# Altium schematic sheet Car_Circuitry.SchDoc
size A3; SheetNumber: 1; SheetTotal: 1
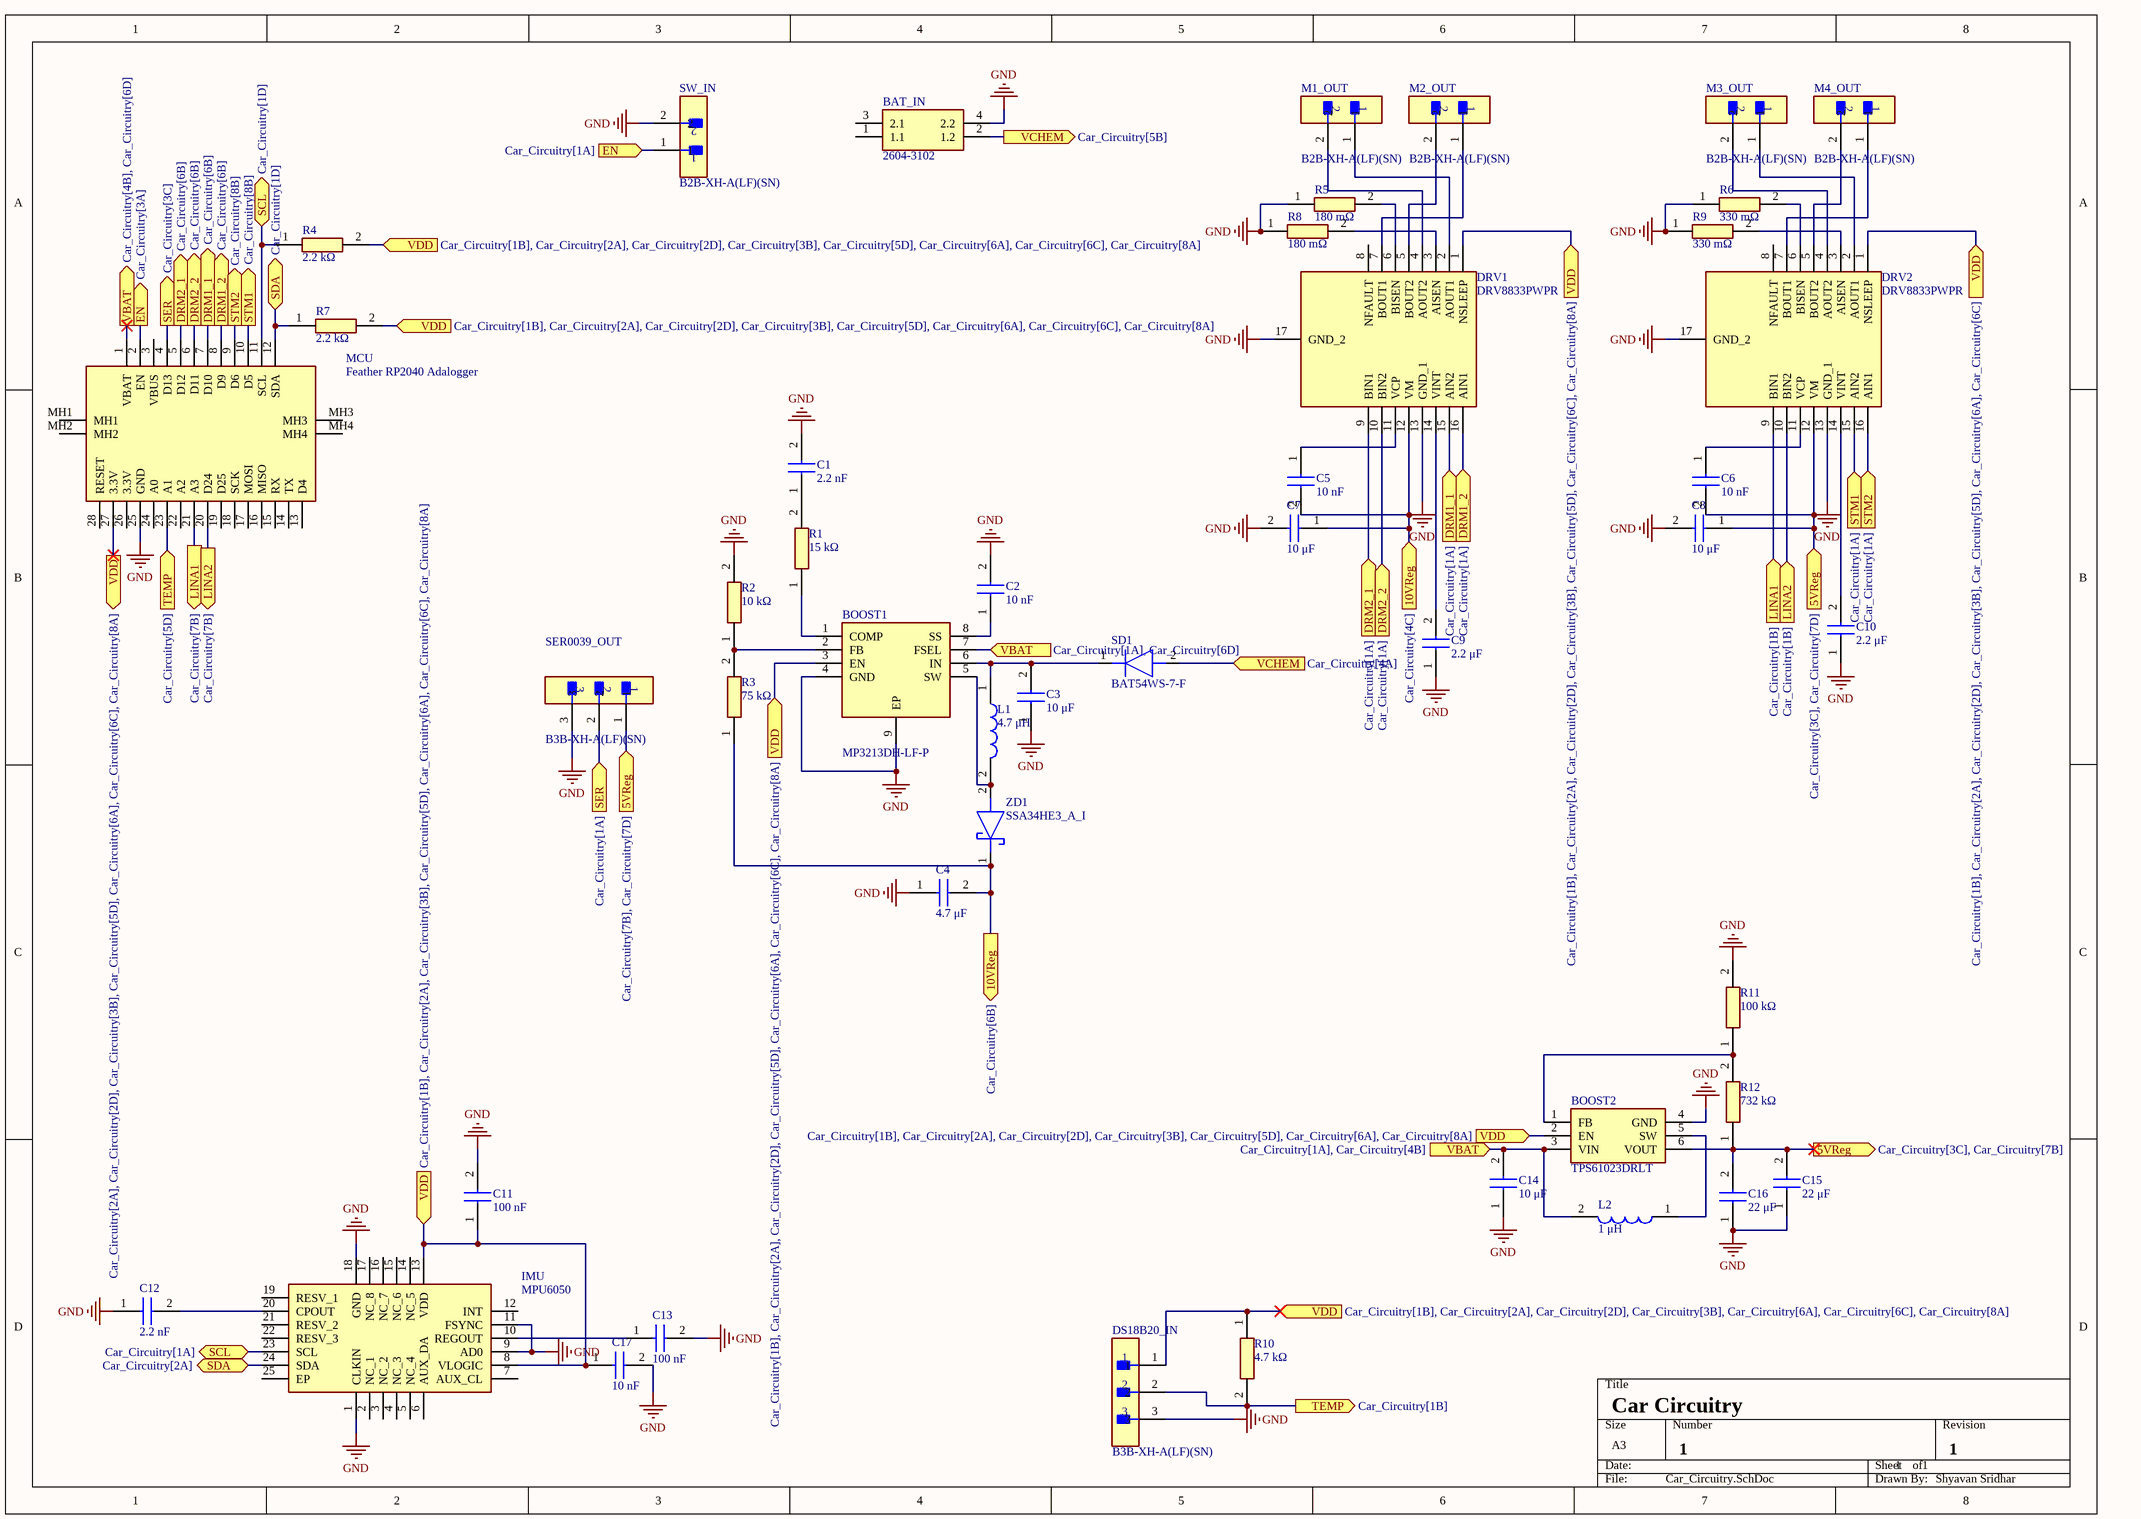
[diagram p0: Car_Circuitry.SchDoc]

## Parts
BAT_IN  2604-3102  [26043102]
BOOST1  MP3213DH-LF-P  [SOP65P490X110-9N]
BOOST2  TPS61023DRLT  [SOTFL50P160X60-6N]
C1  2.2 nF  [CAPC2012X75N]
C2  10 nF  [CAPC2012X75N]
C3  10 μF  [CAPC2012X140N]
C4  4.7 μF  [CAPC2012X135N]
C5  10 nF  [CAPC2012X75N]
C6  10 nF  [CAPC2012X75N]
C7  10 μF  [CAPC2012X140N]
C8  10 μF  [CAPC2012X140N]
C9  2.2 μF  [CAPC2012X135N]
C10  2.2 μF  [CAPC2012X135N]
C11  100 nF  [CAPC2012X95N]
C12  2.2 nF  [CAPC2012X75N]
C13  100 nF  [CAPC2012X95N]
C14  10 μF  [CAPC2012X140N]
C15  22 μF  [CAPC3216X180N]
C16  22 μF  [CAPC3216X180N]
C17  10 nF  [CAPC2012X75N]
DRV1  DRV8833PWPR  [SOP65P640X120-17N]
DRV2  DRV8833PWPR  [SOP65P640X120-17N]
DS18B20_IN  B3B-XH-A(LF)(SN)  [FP-B3B-XH-A_LF_SN-MFG]
IMU  MPU6050  [MPU6050]
L1  4.7 μH  [CDRH8D43NP4R7NC]
L2  1 μH  [74438357010]
M1_OUT  B2B-XH-A(LF)(SN)  [FP-B2B-XH-A_LF_SN-MFG]
M2_OUT  B2B-XH-A(LF)(SN)  [FP-B2B-XH-A_LF_SN-MFG]
M3_OUT  B2B-XH-A(LF)(SN)  [FP-B2B-XH-A_LF_SN-MFG]
M4_OUT  B2B-XH-A(LF)(SN)  [FP-B2B-XH-A_LF_SN-MFG]
MCU  Feather RP2040 Adalogger  [2796]
R1  15 kΩ  [RESC3216X70N]
R2  10 kΩ  [RESC3216X70N]
R3  75 kΩ  [RESC3116X65N]
R4  2.2 kΩ  [RESAD1042W49L330D178]
R5  180 mΩ  [ERJ6_B_BW_R_LW_CW_D]
R6  330 mΩ  [ERJ6_B_BW_R_LW_CW_D]
R7  2.2 kΩ  [RESAD1042W49L330D178]
R8  180 mΩ  [ERJ6_B_BW_R_LW_CW_D]
R9  330 mΩ  [ERJ6_B_BW_R_LW_CW_D]
R10  4.7 kΩ  [RESAD1530W60L610D230]
R11  100 kΩ  [ERJ8ENF1000V]
R12  732 kΩ  [ERJ8ENF1000V]
SD1  BAT54WS-7-F  [SOD2513X120N]
SER0039_OUT  B3B-XH-A(LF)(SN)  [FP-B3B-XH-A_LF_SN-MFG]
SW_IN  B2B-XH-A(LF)(SN)  [FP-B2B-XH-A_LF_SN-MFG]
ZD1  SSA34HE3_A_I  [DIONM5127X229N]

## Ports
5VReg (in, see Car_Circuitry[3C], Car_Circuitry[7D]), 5VReg (in, see Car_Circuitry[7B], Car_Circuitry[7D]), 5VReg (out, see Car_Circuitry[3C], Car_Circuitry[7B]), 10VReg (in, see Car_Circuitry[4C]), 10VReg (out, see Car_Circuitry[6B]), DRM1_1 (in, see Car_Circuitry[1A]), DRM1_1 (out, see Car_Circuitry[6B]), DRM1_2 (in, see Car_Circuitry[1A]), DRM1_2 (out, see Car_Circuitry[6B]), DRM2_1 (in, see Car_Circuitry[1A]), DRM2_1 (out, see Car_Circuitry[6B]), DRM2_2 (in, see Car_Circuitry[1A]), DRM2_2 (out, see Car_Circuitry[6B]), EN (in, see Car_Circuitry[1A]), EN (out, see Car_Circuitry[3A]), LINA1 (in, see Car_Circuitry[1B]), LINA1 (out, see Car_Circuitry[7B]), LINA2 (in, see Car_Circuitry[1B]), LINA2 (out, see Car_Circuitry[7B]), SCL (bidir, see Car_Circuitry[1A]), SCL (bidir, see Car_Circuitry[1D]), SDA (bidir, see Car_Circuitry[1D]), SDA (bidir, see Car_Circuitry[2A]), SER (in, see Car_Circuitry[1A]), SER (out, see Car_Circuitry[3C]), STM1 (in, see Car_Circuitry[1A]), STM1 (out, see Car_Circuitry[8B]), STM2 (in, see Car_Circuitry[1A]), STM2 (out, see Car_Circuitry[8B]), TEMP (in, see Car_Circuitry[5D]), TEMP (out, see Car_Circuitry[1B]), VBAT (in, see Car_Circuitry[1A], Car_Circuitry[4B]), VBAT (in, see Car_Circuitry[1A], Car_Circuitry[6D]), VBAT (out, see Car_Circuitry[4B], Car_Circuitry[6D]), VCHEM (in, see Car_Circuitry[4A]), VCHEM (out, see Car_Circuitry[5B]), VDD (in, see Car_Circuitry[1B], Car_Circuitry[2A], Car_Circuitry[2D], Car_Circuitry[3B], Car_Circuitry[5D], Car_Circuitry[6A], Car_Circuitry[6C]), VDD (in, see Car_Circuitry[1B], Car_Circuitry[2A], Car_Circuitry[2D], Car_Circuitry[3B], Car_Circuitry[5D], Car_Circuitry[6A], Car_Circuitry[6C], Car_Circuitry[8A]), VDD (in, see Car_Circuitry[1B], Car_Circuitry[2A], Car_Circuitry[2D], Car_Circuitry[3B], Car_Circuitry[5D], Car_Circuitry[6A], Car_Circuitry[8A]), VDD (in, see Car_Circuitry[1B], Car_Circuitry[2A], Car_Circuitry[2D], Car_Circuitry[3B], Car_Circuitry[5D], Car_Circuitry[6C], Car_Circuitry[8A]), VDD (in, see Car_Circuitry[1B], Car_Circuitry[2A], Car_Circuitry[2D], Car_Circuitry[3B], Car_Circuitry[6A], Car_Circuitry[6C], Car_Circuitry[8A]), VDD (in, see Car_Circuitry[1B], Car_Circuitry[2A], Car_Circuitry[2D], Car_Circuitry[5D], Car_Circuitry[6A], Car_Circuitry[6C], Car_Circuitry[8A]), VDD (in, see Car_Circuitry[1B], Car_Circuitry[2A], Car_Circuitry[3B], Car_Circuitry[5D], Car_Circuitry[6A], Car_Circuitry[6C], Car_Circuitry[8A]), VDD (out, see Car_Circuitry[2A], Car_Circuitry[2D], Car_Circuitry[3B], Car_Circuitry[5D], Car_Circuitry[6A], Car_Circuitry[6C], Car_Circuitry[8A])

## Nets
GND: BAT_IN.4(2.2) BOOST1.4(GND) BOOST1.9(EP) BOOST2.4(GND) C1.2 C2.2 C3.1 C4.1 C7.2 C8.2 C9.1 C10.1 C11.2 C12.1 C13.2 C14.1 C15.1 C16.1 C17.2 DRV1.13(GND_1) DRV1.17(GND_2) DRV2.13(GND_1) DRV2.17(GND_2) DS18B20_IN.3 IMU.1(CLKIN) IMU.9(AD0) IMU.11(FSYNC) IMU.18(GND) MCU.25(GND) R2.2 R5.1 R6.1 R8.1 R9.1 R11.2 SER0039_OUT.3 SW_IN.2
5VReg: BOOST2.6(VOUT) C6.2 C8.1 C15.2 C16.2 DRV2.12(VM) R12.1 SER0039_OUT.1 ; port 5VReg
10VReg: C4.2 C5.2 C7.1 DRV1.12(VM) R3.1 ZD1.1(K) ; port 10VReg
DRM1_1: DRV1.15(AIN2) MCU.7(D10) ; port DRM1_1
DRM1_2: DRV1.16(AIN1) MCU.8(D9) ; port DRM1_2
DRM2_1: DRV1.9(BIN1) MCU.5(D12) ; port DRM2_1
DRM2_2: DRV1.10(BIN2) MCU.6(D11) ; port DRM2_2
EN: MCU.2(EN) SW_IN.1 ; port EN
LINA1: DRV2.9(BIN1) MCU.21(A3) ; port LINA1
LINA2: DRV2.10(BIN2) MCU.20(D24) ; port LINA2
SCL: IMU.23(SCL) MCU.11(SCL) R4.1 ; port SCL
SDA: IMU.24(SDA) MCU.12(SDA) R7.1 ; port SDA
SER: MCU.4(D13) SER0039_OUT.2 ; port SER
STM1: DRV2.15(AIN2) MCU.10(D5) ; port STM1
STM2: DRV2.16(AIN1) MCU.9(D6) ; port STM2
TEMP: DS18B20_IN.2 MCU.23(A1) R10.2 ; port TEMP
VBAT: BOOST1.7(FSEL) BOOST2.3(VIN) C14.2 L2.2 MCU.1(VBAT) ; port VBAT
VCHEM: BAT_IN.2(1.2) SD1.2(A) ; port VCHEM
VDD: BOOST1.3(EN) BOOST2.2(EN) C11.1 C17.1 DRV1.1(NSLEEP) DRV2.1(NSLEEP) DS18B20_IN.1 IMU.8(VLOGIC) IMU.13(VDD) MCU.27(3.3V) R4.2 R7.2 R10.1 ; port VDD
NetBOOST1_1: BOOST1.1(COMP) R1.1
NetBOOST1_2: BOOST1.2(FB) R2.1 R3.2
NetBOOST1_5: BOOST1.5(SW) L1.2 ZD1.2(A)
NetBOOST1_6: BOOST1.6(IN) C3.2 L1.1 SD1.1(K)
NetBOOST1_8: BOOST1.8(SS) C2.1
NetBOOST2_1: BOOST2.1(FB) R11.1 R12.2
NetBOOST2_5: BOOST2.5(SW) L2.1
NetC1_1: C1.1 R1.2
NetC5_1: C5.1 DRV1.11(VCP)
NetC6_1: C6.1 DRV2.11(VCP)
NetC9_2: C9.2 DRV1.14(VINT)
NetC10_2: C10.2 DRV2.14(VINT)
NetC12_2: C12.2 IMU.20(CPOUT)
NetC13_1: C13.1 IMU.10(REGOUT)
NetDRV1_2: DRV1.2(AOUT1) M1_OUT.1
NetDRV1_3: DRV1.3(AISEN) R8.2
NetDRV1_4: DRV1.4(AOUT2) M1_OUT.2
NetDRV1_5: DRV1.5(BOUT2) M2_OUT.2
NetDRV1_6: DRV1.6(BISEN) R5.2
NetDRV1_7: DRV1.7(BOUT1) M2_OUT.1
NetDRV2_2: DRV2.2(AOUT1) M3_OUT.1
NetDRV2_3: DRV2.3(AISEN) R9.2
NetDRV2_4: DRV2.4(AOUT2) M3_OUT.2
NetDRV2_5: DRV2.5(BOUT2) M4_OUT.2
NetDRV2_6: DRV2.6(BISEN) R6.2
NetDRV2_7: DRV2.7(BOUT1) M4_OUT.1

Not connected (* = marked no-connect by the designer): BAT_IN 1(1.1) 3(2.1); DRV1 8(NFAULT); DRV2 8(NFAULT); IMU 2(NC_1) 3(NC_2) 4(NC_3) 5(NC_4) 6(AUX_DA) 7(AUX_CL) 12(INT) 14(NC_5) 15(NC_6) 16(NC_7) 17(NC_8) 19(RESV_1) 21(RESV_2) 22(RESV_3) 25(EP); MCU 3(VBUS) 13(D4) 14(TX) 15(RX) 16(MISO) 17(MOSI) 18(SCK) 19(D25) 22(A2) 24(A0) 26(3.3V) 28(RESET) MH1 MH2 MH3 MH4

## Notes on the sheet
- Car Circuitry
- 1
- Shyavan Sridhar

## Library data of the parts
BAT_IN = 2604-3102: Connector; Manufacturer_Name: Wago; Datasheet Link: https://wago.priintcloud.com/datasheets/2604-3102/en/b87bf34972496b0cc9989b5aee7282f1?attempt=1&signature=9e8abb936c3e1938ace7bbce61e65315_1h3r8l980; Height: 21.3mm; Manufacturer_Part_Number: 2604-3102; Arrow Part Number: 2604-3102; Arrow Price/Stock: https://www.arrow.com/en/products/2604-3102/wago-kontakttechnik-gmbh?region=nac
BOOST1 = MP3213DH-LF-P: Integrated Circuit; Manufacturer_Name: Monolithic Power Systems (MPS); Datasheet Link: https://www.monolithicpower.com/en/documentview/productdocument/index/version/2/document_type/Datasheet/lang/en/sku/MP3213/document_id/1111/; Height: 1.1mm; Manufacturer_Part_Number: MP3213DH-LF-P; Mouser Part Number: 946-MP3213DHLFP; Mouser Price/Stock: https://www.mouser.co.uk/ProductDetail/Monolithic-Power-Systems-MPS/MP3213DH-LF-P?qs=rC7bBWoQAAkofhl4U2fxww%3D%3D
BOOST2 = TPS61023DRLT: Integrated Circuit; Manufacturer_Name: Texas Instruments; Datasheet Link: http://www.ti.com/general/docs/suppproductinfo.tsp?distId=10&gotoUrl=http%3A%2F%2Fwww.ti.com%2Flit%2Fgpn%2Ftps61023; Height: 0.6mm; Manufacturer_Part_Number: TPS61023DRLT; Mouser Part Number: 595-TPS61023DRLT; Mouser Price/Stock: https://www.mouser.co.uk/ProductDetail/Texas-Instruments/TPS61023DRLT?qs=BJlw7L4Cy78Zr3IJIU3gNw%3D%3D; Arrow Part Number: TPS61023DRLT; Arrow Price/Stock: https://www.arrow.com/en/products/tps61023drlt/texas-instruments?region=nac
C1 C12 = CL21B222KBANNNC: Capacitor; Manufacturer_Name: SAMSUNG; Datasheet Link: http://uk.rs-online.com/web/p/products/7666014; Height: 0.75mm; Manufacturer_Part_Number: CL21B222KBANNNC
C2 C5 C6 C17 = CL21B103KBANNNC: Capacitor; Manufacturer_Name: SAMSUNG; Datasheet Link: https://datasheet.datasheetarchive.com/originals/distributors/Datasheets_SAMA/97c54fb7f716f6f5bd35dfc2c9b17795.pdf; Height: 0.75mm; Manufacturer_Part_Number: CL21B103KBANNNC; Mouser Part Number: 187-CL21B103KBANNNC; Mouser Price/Stock: https://www.mouser.co.uk/ProductDetail/Samsung-Electro-Mechanics/CL21B103KBANNNC?qs=349EhDEZ59oTK9iJ%2FqCMuw%3D%3D; Arrow Part Number: CL21B103KBANNNC; Arrow Price/Stock: https://www.arrow.com/en/products/cl21b103kbannnc/samsung-electro-mechanics?region=europe
C3 C7 C8 C14 = CL21B106KOQNNNE: Capacitor; Manufacturer_Name: SAMSUNG; Datasheet Link: https://datasheet.datasheetarchive.com/originals/distributors/Datasheets_SAMA/a6a503886ec2e900bbf4e5d6e2f8e8b0.pdf; Height: 1.4mm; Manufacturer_Part_Number: CL21B106KOQNNNE; Mouser Part Number: 187-CL21B106KOQNNNE; Mouser Price/Stock: https://www.mouser.co.uk/ProductDetail/Samsung-Electro-Mechanics/CL21B106KOQNNNE?qs=349EhDEZ59r8qgLddyW2Yw%3D%3D; Arrow Part Number: CL21B106KOQNNNE; Arrow Price/Stock: https://www.arrow.com/en/products/cl21b106koqnnne/samsung-electro-mechanics
C4 = CL21B475KOFNNNE: Capacitor; Manufacturer_Name: SAMSUNG; Datasheet Link: https://www.mouser.com/datasheet/2/585/MLCC-1837944.pdf; Height: 1.35mm; Manufacturer_Part_Number: CL21B475KOFNNNE; Mouser Part Number: 187-CL21B475KOFNNNE; Mouser Price/Stock: https://www.mouser.co.uk/ProductDetail/Samsung-Electro-Mechanics/CL21B475KOFNNNE?qs=yOVawPpwOwnciZlYtX6QQA%3D%3D; Arrow Part Number: CL21B475KOFNNNE; Arrow Price/Stock: https://www.arrow.com/en/products/cl21b475kofnnne/samsung-electro-mechanics
C9 C10 = CL21B225KAFNNWE: Capacitor; Manufacturer_Name: SAMSUNG; Datasheet Link: https://product.samsungsem.com/mlcc/CL21B225KAFNNW.do; Height: 1.35mm; Manufacturer_Part_Number: CL21B225KAFNNWE; Mouser Part Number: N/A; Mouser Price/Stock: https://www.mouser.com/Search/Refine.aspx?Keyword=N%2FA; Arrow Part Number: CL21B225KAFNNWE; Arrow Price/Stock: https://www.arrow.com/en/products/cl21b225kafnnwe/samsung-electro-mechanics
C11 C13 = CL21B104KBCNNNC: Capacitor; Manufacturer_Name: SAMSUNG; Datasheet Link: https://datasheet.datasheetarchive.com/originals/distributors/Datasheets_SAMA/86a3eaf0882763ef32124d5901f9b833.pdf; Height: 0.95mm; Manufacturer_Part_Number: CL21B104KBCNNNC; Mouser Part Number: 187-CL21B104KBCNNNC; Mouser Price/Stock: https://www.mouser.co.uk/ProductDetail/Samsung-Electro-Mechanics/CL21B104KBCNNNC?qs=349EhDEZ59pEfpnm5yBEmQ%3D%3D; Arrow Part Number: CL21B104KBCNNNC; Arrow Price/Stock: https://www.arrow.com/en/products/cl21b104kbcnnnc/samsung-electro-mechanics?region=europe
C15 C16 = CL31B226KPHNNNE: Capacitor; Manufacturer_Name: SAMSUNG; Datasheet Link: https://media.digikey.com/pdf/Data%20Sheets/Samsung%20PDFs/CL_Series_MLCC_ds.pdf; Height: 1.8mm; Manufacturer_Part_Number: CL31B226KPHNNNE; Mouser Part Number: 187-CL31B226KPHNNNE; Mouser Price/Stock: https://www.mouser.co.uk/ProductDetail/Samsung-Electro-Mechanics/CL31B226KPHNNNE?qs=EHbfJsBkB6nWZLDFWYPW4w%3D%3D; Arrow Part Number: CL31B226KPHNNNE; Arrow Price/Stock: https://www.arrow.com/en/products/cl31b226kphnnne/samsung-electro-mechanics?region=nac
DRV1 DRV2 = DRV8833PWP: Integrated Circuit; Manufacturer_Name: Texas Instruments; Datasheet Link: https://datasheet.datasheetarchive.com/originals/distributors/Datasheets-SFU2/DSASFU100034615.pdf; Height: 1.2mm; Manufacturer_Part_Number: DRV8833PWP; Mouser Part Number: 595-DRV8833PWP; Mouser Price/Stock: https://www.mouser.co.uk/ProductDetail/Texas-Instruments/DRV8833PWP?qs=luhu8ESwuKyOtvyRUEQSKQ%3D%3D; Arrow Part Number: DRV8833PWP; Arrow Price/Stock: https://www.arrow.com/en/products/drv8833pwp/texas-instruments?region=nac
DS18B20_IN = CMP-17439-000014-3: CONN HEADER VERT 3POS 2.5MM; Max Voltage Rating (DC): 250V; Number of Positions: 3; Current Rating: 3A; Color: Natural; Gender: Male; Wire/Cable Gauge: 22AWG; Contact Resistance: 20mR; Insulation Resistance: 1GR; Insulation Material: Nylon; Contact Plating: Tin; Depth: 5.75mm; Contact Type: Male Pin; Max Operating Temperature: 85°C; Insulation Color: Natural; Voltage Rating (AC): 250V; Connector Type: Header; Orientation: Straight; Fastening Type: Detent; Housing Color: White; Min Operating Temperature: -25°C; Termination: Solder; Voltage Rating: 250V; Series: XH; Pitch: 2.5mm; Contact Shape: Square; Number of Rows: 1; Lead Free: Lead Free; Packaging: Bulk; Mount: Through Hole; Flammability Rating: UL94 V-0; Max Voltage Rating (AC): 250V; REACH SVHC: No SVHC; Housing Material: Polyamide; Contact Material: Brass; Lead Pitch: 2.5mm; Contact Finish - Mating: TIN; Length: 9.9mm; Max Current Rating: 3A; Number of Contacts: 3
IMU = MPU6050: IMU; Manufacturer_Name: TDK; Datasheet Link: https://invensense.tdk.com/wp-content/uploads/2015/02/MPU-6000-Datasheet1.pdf; Height: 0.95mm; Manufacturer_Part_Number: MPU6050
L1 = CDRH8D43NP-4R7NC: Inductor; Manufacturer_Name: Sumida; Datasheet Link: http://products.sumida.com/products/pdf/CDRH8D43.pdf; Height: 4.5mm; Manufacturer_Part_Number: CDRH8D43NP-4R7NC; Mouser Part Number: 851-CDRH8D43NP-4R7NC; Mouser Price/Stock: https://www.mouser.co.uk/ProductDetail/Sumida/CDRH8D43NP-4R7NC?qs=mT6umqgwvA22YFkJdpjddg%3D%3D; Arrow Part Number: CDRH8D43NP-4R7NC; Arrow Price/Stock: https://www.arrow.com/en/products/cdrh8d43np-4r7nc/sumida
L2 = 74438357010: Inductor; Manufacturer_Name: Wurth Elektronik; Datasheet Link: https://katalog.we-online.de/pbs/datasheet/74438357010.pdf; Height: 3.1mm; Manufacturer_Part_Number: 74438357010; Mouser Part Number: 710-74438357010; Mouser Price/Stock: https://www.mouser.co.uk/ProductDetail/Wurth-Elektronik/74438357010?qs=AQlKX63v8RstGPuQmrueWg%3D%3D
M1_OUT M2_OUT M3_OUT M4_OUT SW_IN = CMP-2000-05888-3: CONN HEADER VERT 2POS 2.5MM; Current Rating: 3A; Voltage Rating: 250V; Number of Contacts: 2; Contact Resistance: 20mR; Wire/Cable Gauge: 22AWG; Insulation Resistance: 1GR; Connector Type: Male Pin; Packaging: Bulk; Contact Material: Brass; Lead Free: Lead Free; Orientation: Straight; Contact Plating: Tin; Max Current Rating: 3A; Termination: Solder; Fastening Type: Detent; Depth: 5.75mm; Housing Material: Polyamide; REACH SVHC: No SVHC; Series: XH; Voltage Rating (AC): 250V; Number of Positions: 2; Color: Natural; Contact Type: Male Pin; Max Voltage Rating (DC): 250V; Pitch: 2.5mm; Lead Pitch: 2.5mm; Mount: Through Hole; Max Operating Temperature: 85°C; Length: 7.4mm; Max Voltage Rating (AC): 250V; Min Operating Temperature: -25°C; Number of Rows: 1; Housing Color: White
MCU = 2796: Adafruit Microcontroller; Datasheet Link: https://learn.adafruit.com/adafruit-feather-m0-adalogger/; Height: 8mm; Manufacturer_Name: Adafruit; Manufacturer_Part_Number: 2796; Mouser Part Number: 485-2796; Mouser Price/Stock: https://www.mouser.co.uk/ProductDetail/Adafruit/2796?qs=ivJcBTDythVHyWdm86fBzQ%3D%3D; Arrow Part Number: 2796; Arrow Price/Stock: https://www.arrow.com/en/products/2796/adafruit-industries
R1 = RMCF1206FT15K0: Resistor; Manufacturer_Name: Stackpole Electronics; Datasheet Link: https://cs.seielect.com/catalog/SEI-RMCF_RMCP.pdf; Height: 0.7mm; Manufacturer_Part_Number: RMCF1206FT15K0
R2 = RMCF1206FT10K0: Resistor; Manufacturer_Name: Stackpole Electronics; Datasheet Link: https://cs.seielect.com/catalog/SEI-RMCF_RMCP.pdf; Height: 0.7mm; Manufacturer_Part_Number: RMCF1206FT10K0; Mouser Part Number: 708-RMCF1206FT10K0; Mouser Price/Stock: https://www.mouser.co.uk/ProductDetail/SEI-Stackpole/RMCF1206FT10K0?qs=FESYatJ8odLA3wj6Cpi5%252BQ%3D%3D; Arrow Part Number: RMCF1206FT10K0; Arrow Price/Stock: https://www.arrow.com/en/products/rmcf1206ft10k0/stackpole-electronics?region=nac
R3 = RC1206FR-0775KL: Resistor; Manufacturer_Name: KEMET; Datasheet Link: https://www.sos.sk/productdata/35/10/4/35104/RC1206.pdf; Height: 0.65mm; Manufacturer_Part_Number: RC1206FR-0775KL; Mouser Part Number: 603-RC1206FR-0775KL; Mouser Price/Stock: https://www.mouser.com/Search/Refine.aspx?Keyword=603-RC1206FR-0775KL; Arrow Part Number: RC1206FR-0775KL; Arrow Price/Stock: https://www.arrow.com/en/products/rc1206fr-0775kl/yageo
R4 R7 = RNMF14FTC2K20: Resistor; Manufacturer_Name: Stackpole Electronics; Datasheet Link: https://cs.seielect.com/catalog/SEI-RNF_RNMF.pdf; Manufacturer_Part_Number: RNMF14FTC2K20; Arrow Part Number: RNMF14FTC2K20; Arrow Price/Stock: https://www.arrow.com/en/products/rnmf14ftc2k20/stackpole-electronics
R5 R8 = ERJ-6DSFR18V: Resistor; Manufacturer_Name: Panasonic; Datasheet Link: http://industrial.panasonic.com/cdbs/www-data/pdf/RDN0000/AOA0000C313.pdf; Manufacturer_Part_Number: ERJ-6DSFR18V; Mouser Part Number: 667-ERJ-6DSFR18V; Mouser Price/Stock: https://www.mouser.com/Search/Refine.aspx?Keyword=667-ERJ-6DSFR18V
R6 R9 = ERJ-6DQFR33V: Resistor; Manufacturer_Name: Panasonic; Datasheet Link: http://industrial.panasonic.com/cdbs/www-data/pdf/RDN0000/AOA0000C313.pdf; Manufacturer_Part_Number: ERJ-6DQFR33V; Mouser Part Number: 667-ERJ-6DQFR33V; Mouser Price/Stock: https://www.mouser.co.uk/ProductDetail/Panasonic/ERJ-6DQFR33V?qs=WO7YBshssFGC1sXPY0P8lQ%3D%3D
R10 = CF1_4C472J: Resistor; Manufacturer_Name: KOA Speer; Manufacturer_Part_Number: CF1/4C472J; Datasheet Link: https://componentsearchengine.com/Datasheets/1/CF1_4C472J.pdf; Mouser Part Number: 660-CF1/4C472J; Mouser Price/Stock: https://www.mouser.co.uk/ProductDetail/KOA-Speer/CF1-4C472J?qs=iBCKGqwqm%252BisgvQFSwWfkg%3D%3D; Arrow Part Number: CF1/4C472J; Arrow Price/Stock: https://www.arrow.com/en/products/cf14c472j/koa-speer-electronics?region=nac
R11 = ERJ-8ENF1003V: Resistor; Manufacturer_Name: Panasonic; Datasheet Link: https://industrial.panasonic.com/cdbs/www-data/pdf/RDA0000/AOA0000C86.pdf; Height: 0.7mm; Manufacturer_Part_Number: ERJ-8ENF1003V; Mouser Part Number: 667-ERJ-8ENF1003V; Mouser Price/Stock: https://www.mouser.co.uk/ProductDetail/Panasonic/ERJ-8ENF1003V?qs=8%252BG0TiN%2FgVoayg2hl%252BJeeg%3D%3D; Arrow Part Number: ERJ-8ENF1003V; Arrow Price/Stock: https://www.arrow.com/en/products/erj-8enf1003v/panasonic?region=nac
R12 = ERJ-8ENF7323V: Resistor; Manufacturer_Name: Panasonic; Datasheet Link: https://industrial.panasonic.com/cdbs/www-data/pdf/RDA0000/AOA0000C86.pdf; Height: 0.7mm; Manufacturer_Part_Number: ERJ-8ENF7323V; Mouser Part Number: 667-ERJ-8ENF7323V; Mouser Price/Stock: https://www.mouser.co.uk/ProductDetail/Panasonic/ERJ-8ENF7323V?qs=Ow%252BOiPmaljHJ6lt%2FbxwsiQ%3D%3D
SD1 = BAT54WS-7-F: Diode; Manufacturer_Name: Diodes Incorporated; Datasheet Link: https://www.diodes.com//assets/Datasheets/BAT54WS.pdf; Height: 1.2mm; Manufacturer_Part_Number: BAT54WS-7-F; Mouser Part Number: 621-BAT54WS-F; Mouser Price/Stock: https://www.mouser.co.uk/ProductDetail/Diodes-Incorporated/BAT54WS-7-F?qs=BJo294706GxanB6a%2FKrrdw%3D%3D; Arrow Part Number: BAT54WS-7-F; Arrow Price/Stock: https://www.arrow.com/en/products/bat54ws-7-f/diodes-incorporated?region=nac
SER0039_OUT = CMP-17439-000014-3: CONN HEADER VERT 3POS 2.5MM; Max Voltage Rating (DC): 250V; Number of Positions: 3; Current Rating: 3A; Gender: Male; Wire/Cable Gauge: 22AWG; Contact Resistance: 20mR; Insulation Resistance: 1GR; Insulation Material: Nylon; Contact Plating: Tin; Depth: 5.75mm; Contact Type: Male Pin; Max Operating Temperature: 85°C; Insulation Color: Natural; Voltage Rating (AC): 250V; Color: Natural; Connector Type: Header; Orientation: Straight; Fastening Type: Detent; Housing Color: White; Min Operating Temperature: -25°C; Termination: Solder; Voltage Rating: 250V; Series: XH; Pitch: 2.5mm; Contact Shape: Square; Number of Rows: 1; Lead Free: Lead Free; Packaging: Bulk; Mount: Through Hole; Flammability Rating: UL94 V-0; Max Voltage Rating (AC): 250V; REACH SVHC: No SVHC; Housing Material: Polyamide; Contact Material: Brass; Lead Pitch: 2.5mm; Contact Finish - Mating: TIN; Length: 9.9mm; Max Current Rating: 3A; Number of Contacts: 3
ZD1 = SSA34HE3_A_I: Schottky Diode; Manufacturer_Name: Vishay; Manufacturer_Part_Number: SSA34HE3_A/I; Datasheet Link: https://componentsearchengine.com/Datasheets/1/SSA34HE3_A_I.pdf; Height: 2.29mm; Mouser Part Number: 78-SSA34HE3_A/I; Mouser Price/Stock: https://www.mouser.co.uk/ProductDetail/Vishay-General-Semiconductor/SSA34HE3_A-I?qs=asPD7ZL2j3VimMFbwwU%2FoA%3D%3D; Arrow Part Number: SSA34HE3_A/I; Arrow Price/Stock: https://www.arrow.com/en/products/ssa34he3-ai/vishay?region=nac